# EAGLE design NEW (EAGLE 8.5.0)
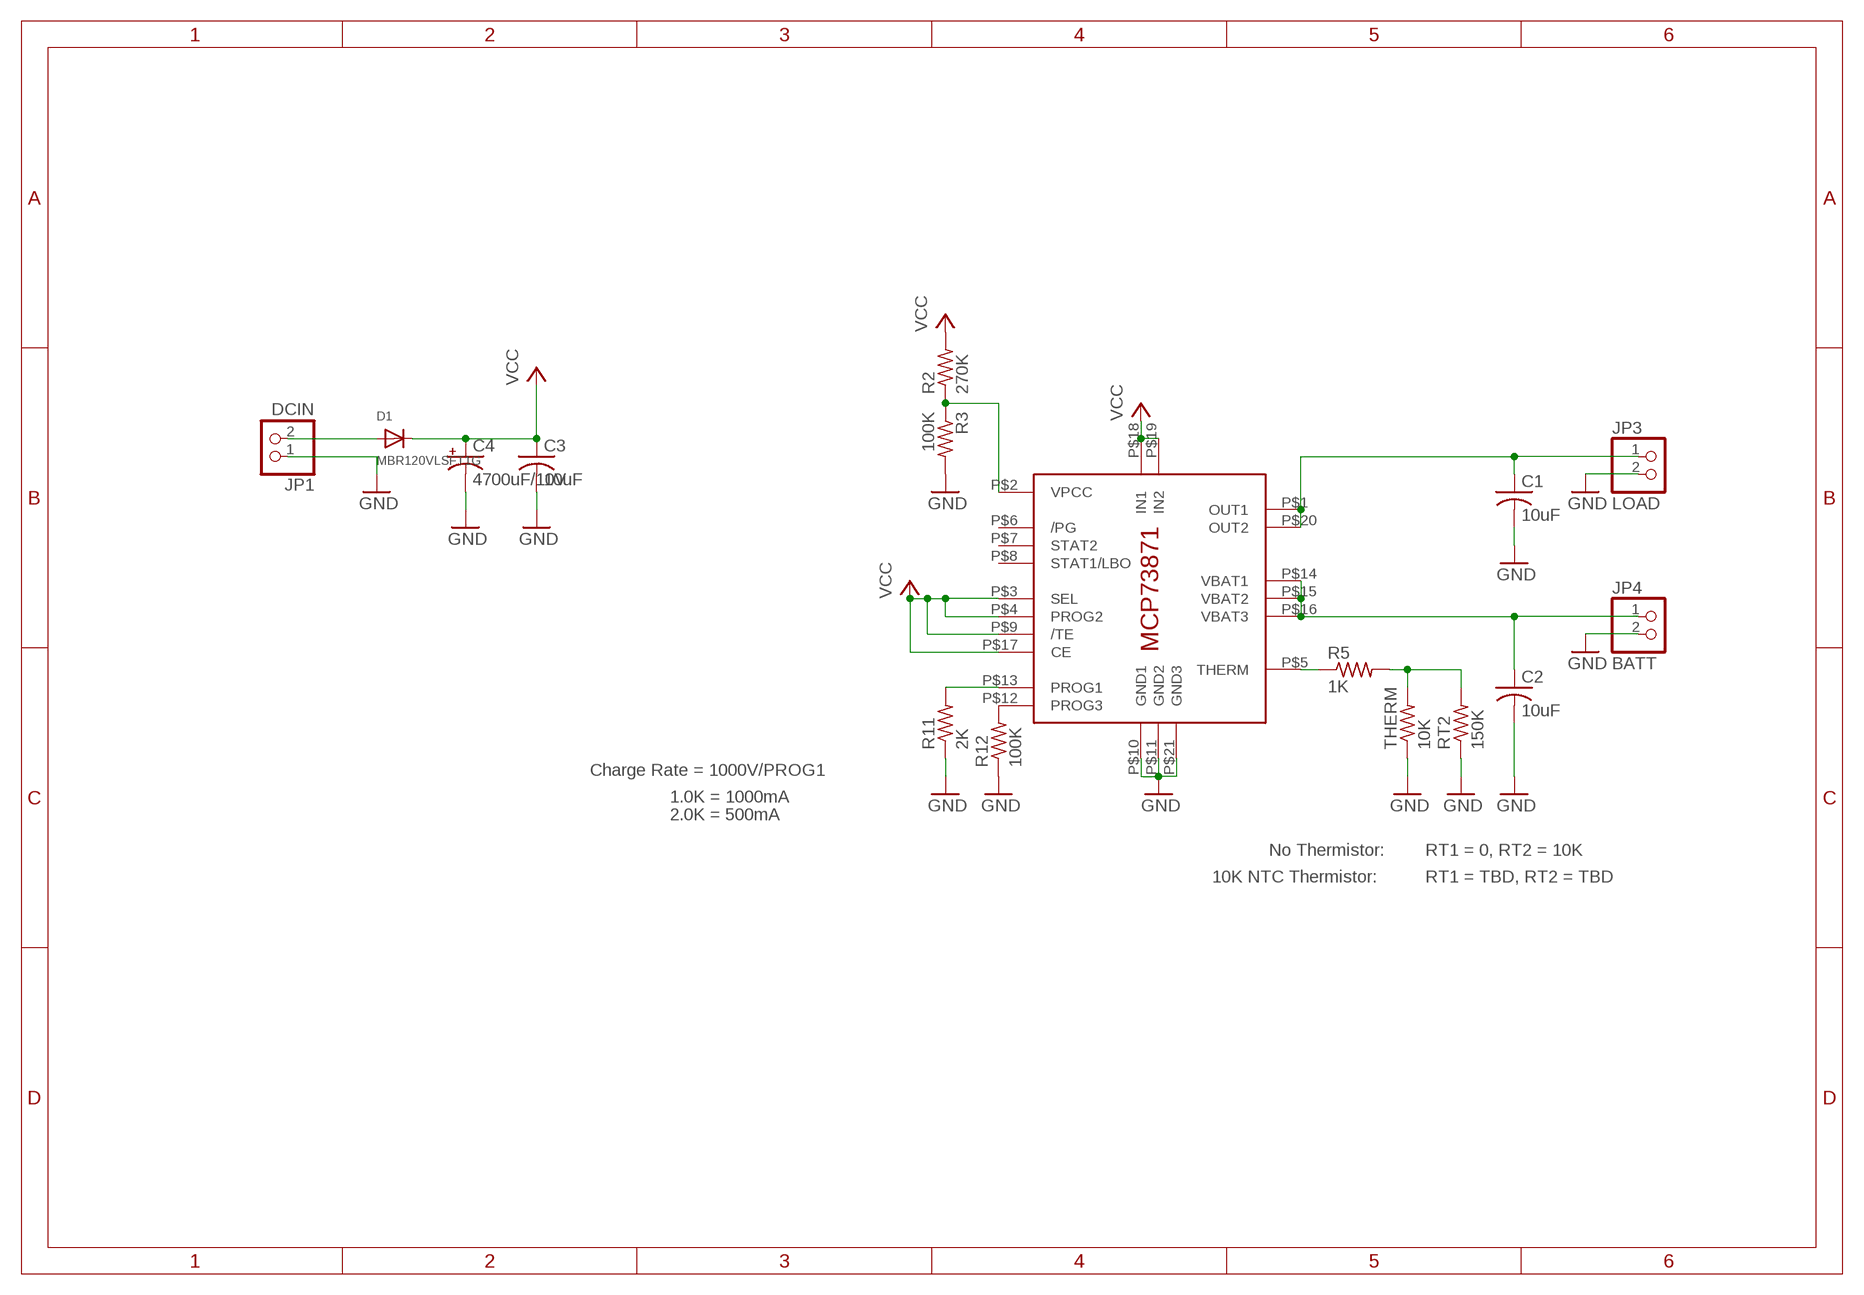
[diagram p0: schematic, sheet 1]

## Parts
C1  10uF  C-USC0805K  [C0805K]
C2  10uF  C-USC0805K  [C0805K]
C3  10uF  C-USC0805K  [C0805K]
C4  4700uF/10V  CPOL-USE5-10.5  [E5-10,5]
D1  MBR120VLSFT1G  DIODESOD-123  [SOD-123]
IC1  MCP73871  [QFN20_4MM]
JP1  DCIN  HEADER-1X2  [1X02_OVAL]
JP3  LOAD  HEADER-1X2ROUND  [1X02_ROUND]
JP4  BATT  HEADER-1X2ROUND  [1X02_ROUND]
R2  270K  R-US_R0805  [R0805]
R3  100K  R-US_R0805  [R0805]
R5  1K  R-US_M0805  [M0805]
R11  2K  R-US_M0805  [M0805]
R12  100K  R-US_R0805  [R0805]
RT2  150K  R-US_M0805  [M0805]
THERM  10K  R-US_M0805  [M0805]

## Nets
BATT: C2.1 IC1.P$14(VBAT1) IC1.P$15(VBAT2) IC1.P$16(VBAT3) JP4.1
GND: C1.2 C2.2 C3.2 C4.- IC1.P$10(GND1) IC1.P$11(GND2) IC1.P$21(GND3) JP1.1 JP3.2 JP4.2 R3.2 R11.1 R12.1 RT2.1 THERM.1
N$2: D1.A JP1.2
N$5: IC1.P$5(THERM) R5.1
N$6: IC1.P$2(VPCC) R2.1 R3.1
N$8: R5.2 RT2.2 THERM.2
N$15: IC1.P$12(PROG3) R12.2
N$16: IC1.P$13(PROG1) R11.2
OUT: C1.1 IC1.P$1(OUT1) IC1.P$20(OUT2) JP3.1
VCC: C3.1 C4.+ D1.C IC1.P$3(SEL) IC1.P$4(PROG2) IC1.P$9(/TE) IC1.P$17(CE) IC1.P$18(IN1) IC1.P$19(IN2) R2.2
Unconnected: IC1.P$6(/PG) IC1.P$7(STAT2) IC1.P$8(STAT1/LBO)

## Notes on the sheet
- Charge Rate = 1000V/PROG1
- 1.0K = 1000mA
- 2.0K = 500mA
- No Thermistor: | RT1 = 0, RT2 = 10K
- 10K NTC Thermistor: | RT1 = TBD, RT2 = TBD

## Library data of the parts
C1-C3 = adafruit:C-US: CAPACITOR, American symbol
C4 = adafruit:CPOL-US: POLARIZED CAPACITOR, American symbol
D1 = microbuilder:DIODE: Diode SMA Model Volts Amps Type Vf Vr Digikey # Notes SSA34-E3 40V 3A Schottky 480mV @ 3A 200uA @ 40V SSA34-E3/61TGITR-ND CDBA120-G 20V 1A Schottky 500mV @ 1A 500uA @ 20V 641-1014-6-ND REEL MBRA210 10V 2A Schottky 350mV @ 2A 700uA @ 10V MBRA210LT3 SOD-123 Model Volts Amps Type Vf Vr Order # Notes BAT54T1G 30V 200mA Schottky 800mV @ 200mA 2uA @ 25V BAT54T1GOSTR-ND B0530W 30V 500mA Schottky 430mV @ 500mA 130uA @ 30V B0530W-FDICT-ND REEL MBR120 20V 1A Schottky 340mV @ 1A MBR120VLSFT1GOSCT-ND SOD-323 Model Volts Amps Type Vf Vr Order # Notes PMEG2005EJ 20V 500mA Schottky 355mV @ 500mA 568-4110-1-ND ZLLS410 10V 570mA Schottky 380mV @ 570mA ZLLS410CT-ND 1N4148WS 75V 150mA Silicon/Simple 1V 1N4148WSFSCT-ND REEL SOD-523 Model Volts Amps Type Vf Vr Order # Notes BAT54XV2 30V 200mA Schottky 0.8V @ 100mA BAT54XV2CT-ND TB751S 30V 30mA Schottky RB751S-40TE61CT-ND SOT23-R/W (R = Solder Paste/Reflow Ovens, W = Hand-Soldering) Model Volts Amps Type Vf Vr Order # Notes BAT54FILM 40V 300mA Schottky 497-7162-1-ND
IC1 = adafruit:MCP73871
JP1 JP3 JP4 = microbuilder:HEADER-1X2: PIN HEADER
R2 R3 R5 R11 R12 RT2 THERM = adafruit:R-US_: RESISTOR, American symbol

## Board
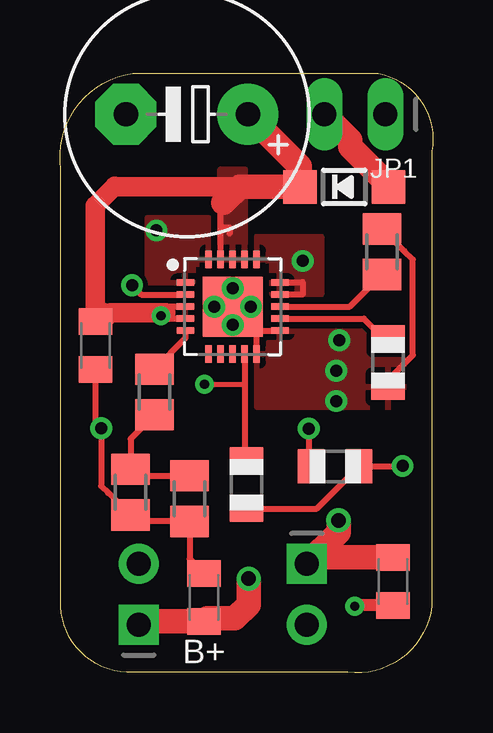
[diagram p1: board, top side]
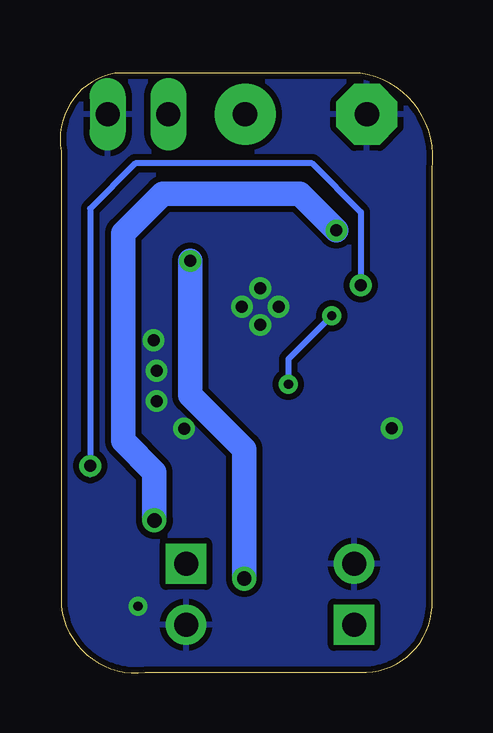
[diagram p2: board, bottom side, seen from below]

Size 15.54 x 24.99 mm. Coordinates in mm from the lower left corner, seen from the top.
Outline: 0.03,3.02 0.03,20.99 arc-90 3.03,24.99 13.25,24.99 arc-90 15.49,21.73 15.49,2.77 arc-90 11.98,0.02 2.78,0.02 arc-90 0.03,3.02
Copper layers (1*16): Top 0.035mm / dielectric 1.5mm / Bottom 0.035mm
Design rules "default *": minimum track width 8mil, minimum drill 15mil, track to track 8mil, track to pad 8mil, pad to pad 8mil, via to via 8mil, smd to smd 8mil, copper to edge 1mil, drill to drill 8mil, minimum pad ring 10mil, minimum via ring 8mil, stop-mask expansion 4mil, vias tented up to drill 24mil, thermal gap 10mil
tRestrict: area 16.3,18 to 16.7,18.1; 9 lines

### Footprints (pad centres in the part's own frame; a part is rotated, then mirrored left to right if it is on the bottom)
C0805K = smd 1.1 x 1.4: 1 -1,0; 2 1,0
E5-10,5 = drill 1.016 pad 2.54: + -2.54,0 | drill 1.016 pad 2.54 octagon: - 2.54,0
SOD-123 = smd 1.4 x 1.4: A 1.85,0; C -1.85,0
QFN20_4MM = smd 0.73 x 0.28: P$1 -1.965,1; P$2 -1.965,0.5; P$3 -1.965,0; P$4 -1.965,-0.5; P$5 -1.965,-1; P$11 1.965,-1; P$12 1.965,-0.5; P$13 1.965,0; P$14 1.965,0.5; P$15 1.965,1 | smd 0.28 x 0.73: P$6 -1,-1.965; P$7 -0.5,-1.965; P$8 0,-1.965; P$9 0.5,-1.965; P$10 1,-1.965; P$16 1,1.965; P$17 0.5,1.965; P$18 0,1.965; P$19 -0.5,1.965; P$20 -1,1.965 | smd 2.5 x 2.5: P$21 0,0
1X02_OVAL = drill 1 long: 1 -1.27,0; 2 1.27,0
1X02_ROUND = drill 1 pad 1.676 square: 1 -1.27,0 | drill 1 pad 1.676: 2 1.27,0
R0805 = smd 1.1 x 1.4: 1 -1,0; 2 1,0
M0805 = smd 1.3 x 1.6: 1 -0.95,0; 2 0.95,0

### Placement (x,y rotation side)
C1  13.87,3.82 270 top
C2  6,3.15 90 top
C3  1.48,13.64 270 top
C4  5.29,23.28 180 top
D1  11.84,20.25 0 top
IC1  7.19,15.26 0 top
JP1  12.29,23.28 180 top
JP3  10.29,3.28 270 top
JP4  3.29,3.28 90 top
R2  7.76,7.85 90 top
R3  11.46,8.61 180 top
R5  3.94,11.71 270 top
R11  13.42,17.55 270 top
R12  13.67,12.93 90 top
RT2  2.94,7.53 90 top
THERM  5.4,7.26 90 top

### Tracks (layer width: path | path; a pad name or v marks a point on that pad's centre or on a via)
BATT  (via drill 0.5, 0.6)
  Top 0.254: v10.11,17.17 10.11,17.42 | IC1.P$14 10.11,15.76 10.11,15.77 10.11,16.28 9.17,16.28 IC1.P$15
  Top 1.016: JP4.1 3.43,2.15 C2.1 6.13,2.28 7.29,2.28 7.86,2.85 v7.86,3.93
  Bottom 1.016: v10.11,17.17 10.11,11.57 7.86,9.32 v7.86,3.93
  pour Top: 8.21,17.17 8.21,18.18 10.88,18.18 10.88,15.77 8.84,15.77 8.84,17.17
GND  (via drill 0.38, 0.5)
  Top 0.203: 13.79,2.78 C1.2
  Top 0.254: 8.19,14.26 IC1.P$11 | IC1.P$10 8.19,14.23 | 8.19,14.23 8.21,14.25 | 8.19,14.23 7.92,14.5 v7.19,14.5 | v10.37,10.18 10.37,8.7 R3.2 | C3.2 1.48,10.44 v1.72,10.2 1.72,7.79 2,7.5 2.02,7.5 RT2.1 3.21,6.31 THERM.1 5.4,4.75 C2.2 | R12.1 13.67,12.21 14.7,13.24 14.7,17.23 14.35,17.58 14.34,17.58 R11.1
  Top 0.406: IC1.P$21 v7.96,15.26
  Top 0.508: C1.2 12.33,2.82 v12.29,2.78
  other vias: 11.51,11.32 11.51,12.59 11.64,13.86 7.19,16.02 6.43,15.26
  pour Bottom (isolate 0.254): -4.22,-1.23 -0.48,25.5 16,25.24 18,-0.49
  pour Top: 8.21,14.25 14.31,14.25 14.31,11.07 8.21,11.07
N$2
  Top 1.016: JP1.2 12.09,22.2 12.09,21.91 13.69,20.31 D1.A
N$5
  Top 0.254: IC1.P$5 5.23,13.95 R5.1
N$6  (via drill 0.5)
  Top 0.254: IC1.P$2 3.39,15.76 v3,16.15 | 12.65,8.61 R3.1 | R3.1 12.46,8.66 | R2.1 10.7,6.85 R3.1 | R3.1 14.26,8.61 v14.27,8.63
  Bottom 0.203: 14.29,8.78 v14.27,8.63
  Bottom 0.254: v3,16.15 3,19.2 5.03,21.23 12.4,21.23 14.29,19.34 14.29,8.78 14.29,8.28
N$8
  Top 0.254: R5.2 2.94,9.76 RT2.2 3.21,8.21 THERM.2
N$15
  Top 0.254: IC1.P$12 12.66,14.76 13.5,13.93 R12.2
N$16
  Top 0.254: IC1.P$13 12.08,15.26 R11.2
OUT  (via drill 0.5, 0.6)
  Top 1.016: v11.6,6.36 11.6,5.86 JP3.1 10.56,4.82 C1.1
  Bottom 1.016: v4.02,18.44 5.54,19.96 11.26,19.96 12.91,18.31 12.91,9.67 11.6,8.37 v11.6,6.36
  pour Top: 6.18,17.04 6.18,18.94 3.64,18.94 3.64,16.28 5.54,16.28 5.54,17.04
VCC  (via drill 0.38)
  Top 0.203: v6.02,12.02 7.69,12.02 | v4.21,14.88 4.21,15.01
  Top 0.254: IC1.P$3 4.4,15.26 4.4,15.01 | 7.07,18.31 7.07,18.56 6.69,18.56 IC1.P$19 6.69,19.46 6.81,19.58 | IC1.P$4 3.88,14.76 arc-90 3.64,15.01 | IC1.P$9 7.69,12.02 7.69,8.92 R2.2
  Top 0.813: C3.1 1.75,14.64 2.11,15.01 3.64,15.01 4.21,15.01 4.4,15.01 | 1.84,15.01 C3.1 | C3.1 1.48,19.47 2.29,20.28 2.32,20.25 7.48,20.25
  Top 1.016: 6.81,19.58 7.48,20.25 D1.C 9.99,21.11 C4.+
  Bottom 0.254: v4.21,14.88 6.02,13.07 v6.02,12.02
  pour Top: 6.69,17.1 6.69,20.98 7.7,20.98 7.7,17.1
  pour Top: 5.29,15.26 2.62,15.26 2.62,14.75 5.29,14.75

### Text on the board
tPlace: B+